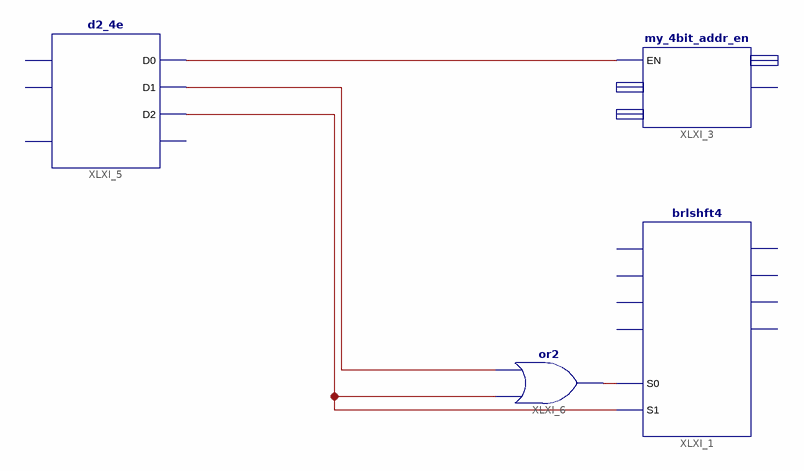
[diagram p0: schematic sheet 1]
// Xilinx ISE schematic my_aly.sch (virtex6) as structural Verilog: 4 symbols, 0 ports
module my_aly (
);

  wire XLXN_3, XLXN_4, XLXN_5, XLXN_7;

  brlshft4 XLXI_1 (.S0(XLXN_3), .S1(XLXN_5));  // open: I0, I1, I2, I3, O0, O1, O2, O3
  my_4bit_addr_en XLXI_3 (.EN(XLXN_7));  // open: A, B, C, S
  d2_4e XLXI_5 (.D0(XLXN_7), .D1(XLXN_4), .D2(XLXN_5));  // open: A0, A1, E, D3
  or XLXI_6 (XLXN_3, XLXN_5, XLXN_4);
endmodule
